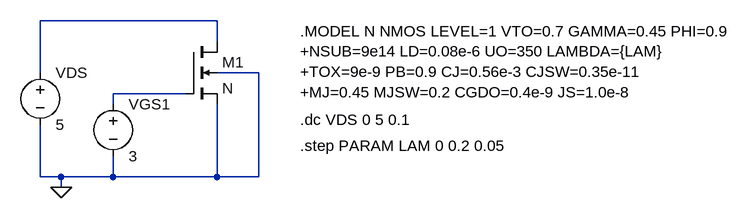
[diagram p0: schematic MOSFET-Lambda.asc]
MOSFET-Lambda.asc, the LTspice schematic file:
Version 4
SHEET 1 880 680
WIRE -32 -16 -304 -16
WIRE -32 16 -32 -16
WIRE -304 64 -304 -16
WIRE 32 64 -32 64
WIRE -80 96 -192 96
WIRE -192 112 -192 96
WIRE -304 224 -304 144
WIRE -272 224 -304 224
WIRE -192 224 -192 192
WIRE -192 224 -272 224
WIRE -32 224 -32 112
WIRE -32 224 -192 224
WIRE 32 224 32 64
WIRE 32 224 -32 224
WIRE -272 240 -272 224
FLAG -272 240 0
SYMBOL nmos4 -80 16 R0
SYMATTR InstName M1
SYMATTR Value N
SYMATTR Value2 l=4u w=1u
SYMBOL voltage -304 48 R0
WINDOW 123 0 0 Left 0
WINDOW 39 0 0 Left 0
SYMATTR InstName VDS
SYMATTR Value 5
SYMBOL voltage -192 96 R0
WINDOW 123 0 0 Left 0
WINDOW 39 0 0 Left 0
SYMATTR InstName VGS1
SYMATTR Value 3
TEXT 96 0 Left 2 !.MODEL N NMOS LEVEL=1 VTO=0.7 GAMMA=0.45 PHI=0.9\n+NSUB=9e14 LD=0.08e-6 UO=350 LAMBDA={LAM}\n+TOX=9e-9 PB=0.9 CJ=0.56e-3 CJSW=0.35e-11\n+MJ=0.45 MJSW=0.2 CGDO=0.4e-9 JS=1.0e-8
TEXT 96 136 Left 2 !.dc VDS 0 5 0.1
TEXT 96 176 Left 2 !.step PARAM LAM 0 0.2 0.05

The netlist it stands for:
* MOSFET-Lambda.asc
M1 N001 N002 0 0 N l=4u w=1u
VDS N001 0 5
VGS1 N002 0 3
.model NMOS NMOS
.model PMOS PMOS
.lib standard.mos
.MODEL N NMOS LEVEL=1 VTO=0.7 GAMMA=0.45 PHI=0.9
+NSUB=9e14 LD=0.08e-6 UO=350 LAMBDA={LAM}
+TOX=9e-9 PB=0.9 CJ=0.56e-3 CJSW=0.35e-11
+MJ=0.45 MJSW=0.2 CGDO=0.4e-9 JS=1.0e-8
.dc VDS 0 5 0.1
.step PARAM LAM 0 0.2 0.05
.backanno
.end